# Altium schematic sheet [5] EV 4.10.13.SchDoc
size A4; DocumentNumber: 6; SheetNumber: 6; SheetTotal: 11
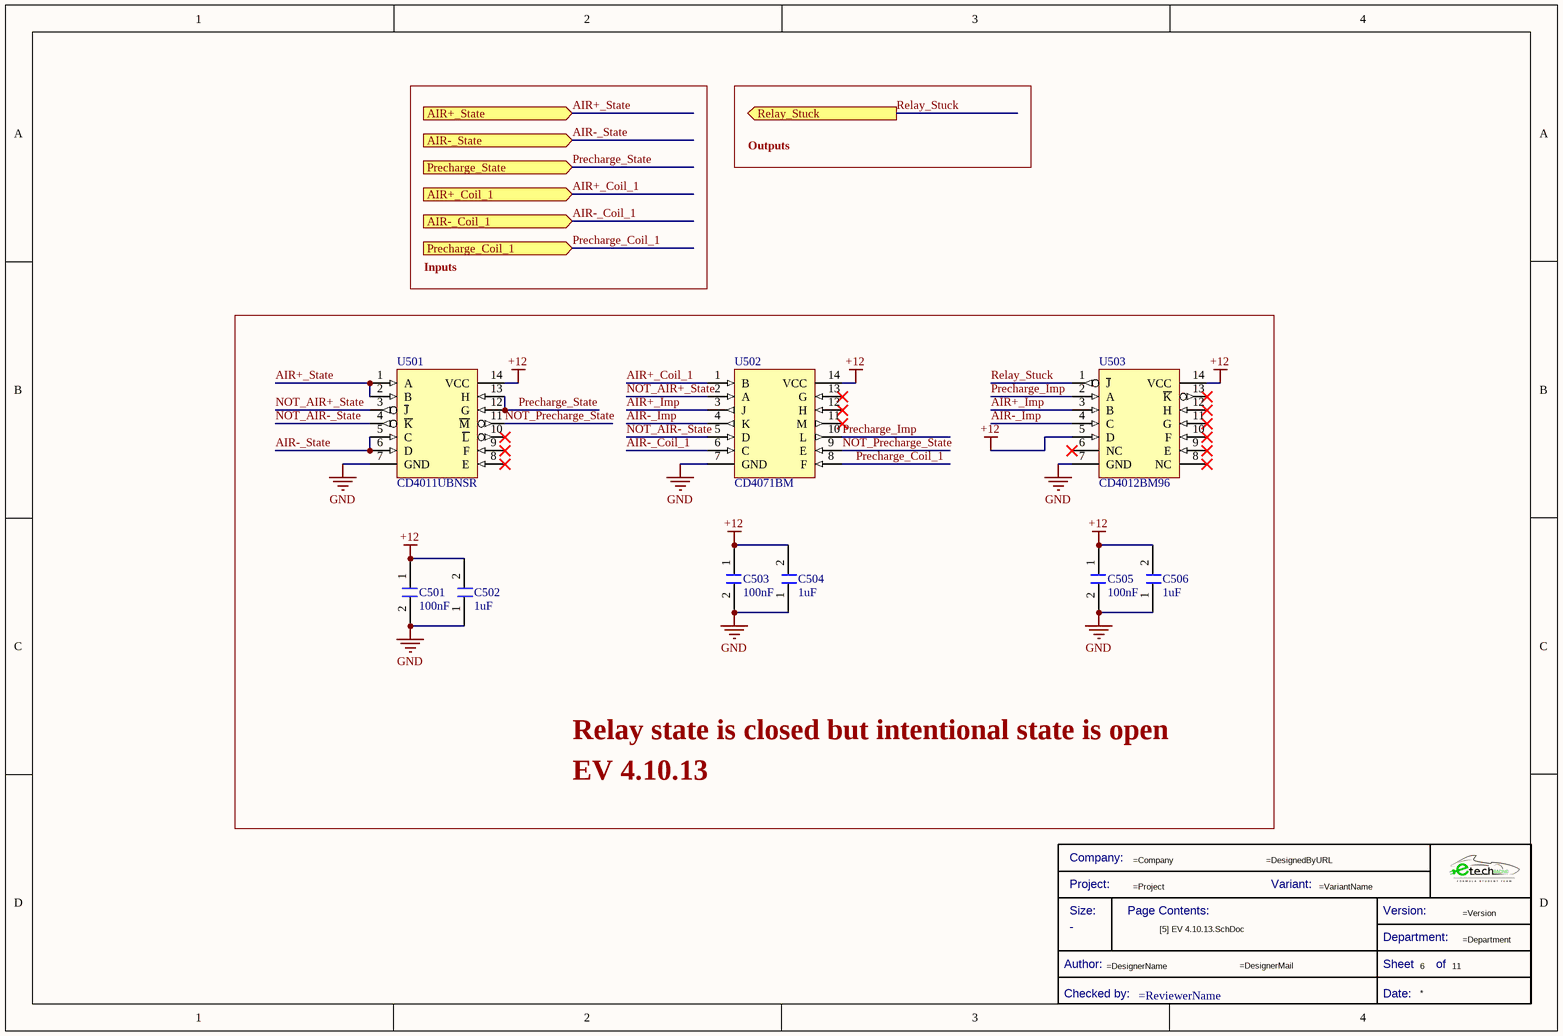
[diagram p0: [5] EV 4.10.13.SchDoc]

## Parts
*?  Title Block_template  (value not drawn)  (graphical)
C501  Capacitance: 100nF  [C0805FNPC-R]  (hidden comment: 885012207098)
C502  Capacitance: 1uF  [C0805FNPC-R]  (hidden comment: 885012207103)
C503  Capacitance: 100nF  [C0805FNPC-R]  (hidden comment: 885012207098)
C504  Capacitance: 1uF  [C0805FNPC-R]  (hidden comment: 885012207103)
C505  Capacitance: 100nF  [C0805FNPC-R]  (hidden comment: 885012207098)
C506  Capacitance: 1uF  [C0805FNPC-R]  (hidden comment: 885012207103)
U501  Manufacturer Part Number: CD4011UBNSR  [ARRAY_4_NAND]  (hidden comment: CD4011UBSNR)
U502  CD4071BM  [Array_4_OR]
U503  CD4012BM96  [ARRAY_4_NAND]

## Ports
AIR+_Coil_1 (in), AIR+_State (in), AIR-_Coil_1 (in), AIR-_State (in), Precharge_Coil_1 (in), Precharge_State (in), Relay_Stuck (out)

## Nets
+12: C501.1 C502.2 C503.1 C504.2 C505.1 C506.2 U501.14(VCC) U502.14(VCC) U503.5(D) U503.14(VCC)
GND: C501.2 C502.1 C503.2 C504.1 C505.2 C506.1 U501.7(GND) U502.7(GND) U503.7(GND)
AIR+_Coil_1: U502.1(B) ; port AIR+_Coil_1
AIR+_Imp: U502.3(J) U503.3(B)
AIR+_State: U501.1(A) U501.2(B) ; port AIR+_State
AIR-_Coil_1: U502.6(C) ; port AIR-_Coil_1
AIR-_Imp: U502.4(K) U503.4(C)
AIR-_State: U501.5(C) U501.6(D) ; port AIR-_State
NOT_AIR+_State: U501.3(~{J}) U502.2(A)
NOT_AIR-_State: U501.4(~{K}) U502.5(D)
NOT_Precharge_State: U501.11(~{M}) U502.9(E)
Precharge_Coil_1: U502.8(F) ; port Precharge_Coil_1
Precharge_Imp: U502.10(L) U503.2(A)
Precharge_State: U501.12(G) U501.13(H) ; port Precharge_State
Relay_Stuck: U503.1(~{J}) ; port Relay_Stuck

Not connected (* = marked no-connect by the designer): U501 8(E)* 9(F)* 10(~{L})*; U502 11(M)* 12(H)* 13(G)*; U503 6(NC)* 8(NC)* 9(E)* 10(F)* 11(G)* 12(H)* 13(~{K})*

## Notes on the sheet
- Outputs
- Inputs
- Relay state is closed but intentional state is open
- EV 4.10.13
- (in symbol Title Block_template) Company:; Project:; Variant:; Size:; Page Contents:; Version:; Department:; Author:; Sheet; of; Checked by:; Date:

## Library data of the parts
*? = Title Block_template: Standard Title Block; Category: Title Block; Checked by:: =ReviewerName; Size: -
C501 C503 C505 = C100n-50V-0805FNPC-X7R: Cap, 0.1ΜF, 50V, 10%, X7R, 0805; Manufacturer 1: Wurth Electronics; .Creator: DR; Supplier 1: RSComponents; Manufacturer Part Number 1: 885012207098; RoHS: Yes; Category: Ceramic Capacitors; Stock 1: 8000; Pricing 1: 100=0,10200, 500=0,07100, 2000=0,06100 (GBP); Mount: Surface Mount; Case/Package: 0805; Case Code (Metric): 2012; Case Code (Imperial): 0805; Min Operating Temperature: -55°C; Max Operating Temperature: 125°C; Packaging: Cut Tape; Voltage Rating: 50V; Dielectric: X7R; Tolerance: 10%; Voltage Rating (DC): 50V; Length: 0.079inch; Width: 0.049inch; Thickness: 0.035inch; REACH SVHC: Unknown; RoHS Compliant: Yes; ComponentLink1URL: http://www.farnell.com/datasheets/1958498.pdf?src-supplier=Farnell; ComponentLink1Description: http://www.farnell.com/datasheets/1958498.pdf?src-supplier=Farnell; ComponentLink2URL: http://www.farnell.com/datasheets/1958498.pdf?src-supplier=Element14; ComponentLink2Description: http://www.farnell.com/datasheets/1958498.pdf?src-supplier=Element14; ComponentLink3URL: https://katalog.we-online.de/pbs/datasheet/885012207098.pdf?src-supplier=Digi-Key; ComponentLink3Description: https://katalog.we-online.de/pbs/datasheet/885012207098.pdf?src-supplier=Digi-Key; ComponentLink4URL: http://www.farnell.com/datasheets/1958498.pdf?src-supplier=Newark; ComponentLink4Description: http://www.farnell.com/datasheets/1958498.pdf?src-supplier=Newark; Supplier Part Number 1: 1813493
C502 C504 C506 = C1u-50V-0805FNPC-X7R: Multilayer Ceramic Capacitor, Wcap-Csgp Series, 1 F, 10%, X7R, 50 V, 0805 [2012 Metric] Rohs Compliant: Yes; Manufacturer 1: Wurth Electronics; Voltage Rating: 50V; .Creator: GP; Supplier 1: RSComponents; Manufacturer Part Number 1: 885012207103; RoHS: Yes; Category: Ceramic Capacitors; Stock 1: 5100; Pricing 1: 50=0,27200, 250=0,25300, 500=0,22800, 1250=0,20100, 2500=0,17100 (GBP); Mount: Surface Mount; Case/Package: 0805; Case Code (Metric): 2012; Case Code (Imperial): 0805; Min Operating Temperature: -55°C; Max Operating Temperature: 85°C; Packaging: Cut Tape; Dielectric: X7R; Tolerance: 10%; Voltage Rating (DC): 50V; Length: 0.079inch; Width: 0.049inch; Thickness: 0.053inch; REACH SVHC: Unknown; RoHS Compliant: Yes; ComponentLink1URL: http://www.farnell.com/datasheets/1958501.pdf?src-supplier=Farnell; ComponentLink1Description: http://www.farnell.com/datasheets/1958501.pdf?src-supplier=Farnell; ComponentLink2URL: http://www.farnell.com/datasheets/1958501.pdf?src-supplier=Element14; ComponentLink2Description: http://www.farnell.com/datasheets/1958501.pdf?src-supplier=Element14; ComponentLink3URL: https://katalog.we-online.de/pbs/datasheet/885012107003.pdf?src-supplier=Digi-Key; ComponentLink3Description: https://katalog.we-online.de/pbs/datasheet/885012107003.pdf?src-supplier=Digi-Key; ComponentLink4URL: http://www.farnell.com/datasheets/1958501.pdf?src-supplier=Newark; ComponentLink4Description: http://www.farnell.com/datasheets/1958501.pdf?src-supplier=Newark; Supplier Part Number 1: 1813523
U501 = Array_4x2_NAND: CD4011UB Cmos Quad 2-INPUT Nand; Manufacturer: Texas Instruments; Logic Function: NAND GATE; Min Supply Voltage: 3V; Max Supply Voltage: 18V; Number of Inputs: 2; Propagation Delay: 50ns; Number of Outputs: 1; Number of Circuits: 4; Quiescent Current: 5uA; High Level Output Current: 3.4mA; Output Current: 6.8mA; Turn-On Delay Time: 120ns; .Creator: DO; Supplier 1: Digi-Key; RoHS: Yes; Category: Logic Gates; Stock 1: 964; Pricing 1: 1=0,67000, 10=0,59100, 25=0,55520, 100=0,45320, 250=0,42096, 500=0,35828, 1000=0,29575 (USD); Mount: Surface Mount; Case/Package: SOP; Number of Pins: 14; Weight: 0.007348oz; Contact Plating: Gold; Min Operating Temperature: -55°C; Max Operating Temperature: 125°C; Package Quantity: 1; Packaging: Tape and Reel; Low Level Output Current: 3.4mA; Number of Gates: 4; Number of Input Lines: 2; Number of Output Lines: 1; Number of Elements: 4; Series: 4000B; Technology: CMOS; Number of Bits: 4; Lead Free: Lead Free; RoHS Compliant: Yes; ComponentLink1URL: https://datasheet.ciiva.com/6621/cd4011ub-6621174.pdf?src-supplier=Digi-Key; ComponentLink1Description: https://datasheet.ciiva.com/6621/cd4011ub-6621174.pdf?src-supplier=Digi-Key; ComponentLink2URL: https://datasheet.ciiva.com/6621/cd4011ub-6621175.pdf?src-supplier=Digi-Key; ComponentLink2Description: https://datasheet.ciiva.com/6621/cd4011ub-6621175.pdf?src-supplier=Digi-Key; ComponentLink3URL: https://datasheet.ciiva.com/14307/cd4011ub-mil-14307943.pdf?src-supplier=Avnet; ComponentLink3Description: https://datasheet.ciiva.com/14307/cd4011ub-mil-14307943.pdf?src-supplier=Avnet; ComponentLink4URL: https://datasheet.ciiva.com/6621/cd4011ub-6621176.pdf?src-supplier=Digi-Key; ComponentLink4Description: https://datasheet.ciiva.com/6621/cd4011ub-6621176.pdf?src-supplier=Digi-Key; Supplier Part Number 1: 296-31485-1-ND; ComponentLink5Description: Where buy it; ComponentLink5URL: https://www.digikey.es/es/products/detail/texas-instruments/CD4011UBNSR/1690702?s=N4IgTCBcDaIMIBEAsAGAjGgqgIQHIGUAlAAhAF0BfIA
U502 = Array_4x2_OR: 4-ch, 2-input, 3-V to 18-V OR gates 14-SOIC -55 to 125; Manufacturer: Texas Instruments; Propagation Delay: 90ns; Max Supply Voltage: 18V; Min Supply Voltage: 3V; Number of Inputs: 2; Number of Outputs: 1; Logic Function: OR GATE; Output Current: 6.8mA; Number of Gates: 4; Low Level Output Current: 4.2mA; Quiescent Current: 5uA; High Level Output Current: -4.2mA; Input Capacitance: 5pF; Power Dissipation: 500mW; .Creator: DO; Supplier 1: Digi-Key; RoHS: Yes; Category: Logic Gates; Stock 1: 4154; Pricing 1: 1=1,26000, 10=1,12600, 25=1,06840, 100=0,87770, 250=0,82044, 500=0,72504, 1000=0,63000 (USD); Mount: Surface Mount; Case/Package: SOIC; Number of Pins: 14; Weight: 0.004564oz; Contact Plating: Gold; Min Operating Temperature: -55°C; Max Operating Temperature: 125°C; Packaging: Rail/Tube; Package Quantity: 50; Number of Input Lines: 2; Number of Output Lines: 1; Number of Circuits: 4; Number of Elements: 4; Turn-On Delay Time: 90ns; Number of Bits: 4; Radiation Hardening: No; Lead Free: Lead Free; RoHS Compliant: Yes; REACH SVHC: No SVHC; ComponentLink1URL: https://datasheet.ciiva.com/1508/1852948-1508179.pdf?src-supplier=Element14; ComponentLink1Description: https://datasheet.ciiva.com/1508/1852948-1508179.pdf?src-supplier=Element14; ComponentLink2URL: https://datasheet.ciiva.com/1866/cd4071b-1866594.pdf?src-supplier=Digi-Key; ComponentLink2Description: https://datasheet.ciiva.com/1866/cd4071b-1866594.pdf?src-supplier=Digi-Key; ComponentLink3URL: https://datasheet.ciiva.com/41455/001015512-da-01-en-ic-2-input-or-gate-cd4071bm-soic-14-tid-41455429.pdf?src-supplier=Conrad; ComponentLink3Description: https://datasheet.ciiva.com/41455/001015512-da-01-en-ic-2-input-or-gate-cd4071bm-soic-14-tid-41455429.pdf?src-supplier=Conrad; Supplier Part Number 1: 296-14278-5-ND; ComponentLink4Description: Where buy it; ComponentLink4URL: https://www.mouser.es/ProductDetail/Texas-Instruments/CD4071BM?qs=D5pVkbrsqqJ%252Bo9qTeo0l1g%3D%3D; Manufacturer Part Number: CD4071BM
U503 = Array_2x4_NAND: 2-ch, 4-input, 3-V to 18-V NAND gates 14-SOIC -55 to 125; Manufacturer 1: Texas Instruments; Output Current: 6.8mA; Number of Inputs: 4; Propagation Delay: 90ns; Number of Elements: 2; Max Supply Voltage: 18V; Min Supply Voltage: 3V; Number of Outputs: 1; Quiescent Current: 5uA; High Level Output Current: 3.4mA; Turn-On Delay Time: 250ns; Schmitt Trigger Input: No; Supplier 1: Digi-Key; Manufacturer Part Number 1: CD4012BM96; RoHS: Yes; Category: Logic Gates; Stock 1: 5313; Pricing 1: 1=0,66000, 10=0,56800, 25=0,53040, 100=0,42440, 250=0,39412, 500=0,33348, 1000=0,25769 (USD); Mount: Surface Mount; Case/Package: SOIC; Number of Pins: 14; Weight: 0.004564oz; Contact Plating: Gold; Min Operating Temperature: -55°C; Max Operating Temperature: 125°C; Packaging: Tape and Reel; Package Quantity: 1; Logic Function: NAND GATE; Number of Circuits: 2; Low Level Output Current: 3.4mA; Number of Gates: 2; Number of Input Lines: 4; Number of Output Lines: 1; Number of Bits: 2; Series: 4000B; Technology: CMOS; Length: 8.65mm; Width: 3.91mm; Height: 1.58mm; Radiation Hardening: No; Lead Free: Lead Free; RoHS Compliant: Yes; Reach SVHC Compliant: Yes; ComponentLink1URL: https://datasheet.ciiva.com/1865/cd4011b-1865256.pdf?src-supplier=Digi-Key; ComponentLink1Description: https://datasheet.ciiva.com/1865/cd4011b-1865256.pdf?src-supplier=Digi-Key; ComponentLink2URL: https://datasheet.ciiva.com/1865/cd4011b-1865255.pdf?src-supplier=Digi-Key; ComponentLink2Description: https://datasheet.ciiva.com/1865/cd4011b-1865255.pdf?src-supplier=Digi-Key; ComponentLink3URL: https://datasheet.ciiva.com/1865/cd4011b-1865257.pdf?src-supplier=Digi-Key; ComponentLink3Description: https://datasheet.ciiva.com/1865/cd4011b-1865257.pdf?src-supplier=Digi-Key; ComponentLink4URL: https://datasheet.ciiva.com/14307/cd4023b-14307967.pdf?src-supplier=Avnet; ComponentLink4Description: https://datasheet.ciiva.com/14307/cd4023b-14307967.pdf?src-supplier=Avnet; Supplier Part Number 1: 296-14246-1-ND